# EAGLE design OSI_BORD_HACKADEMY (EAGLE 9.3.2)
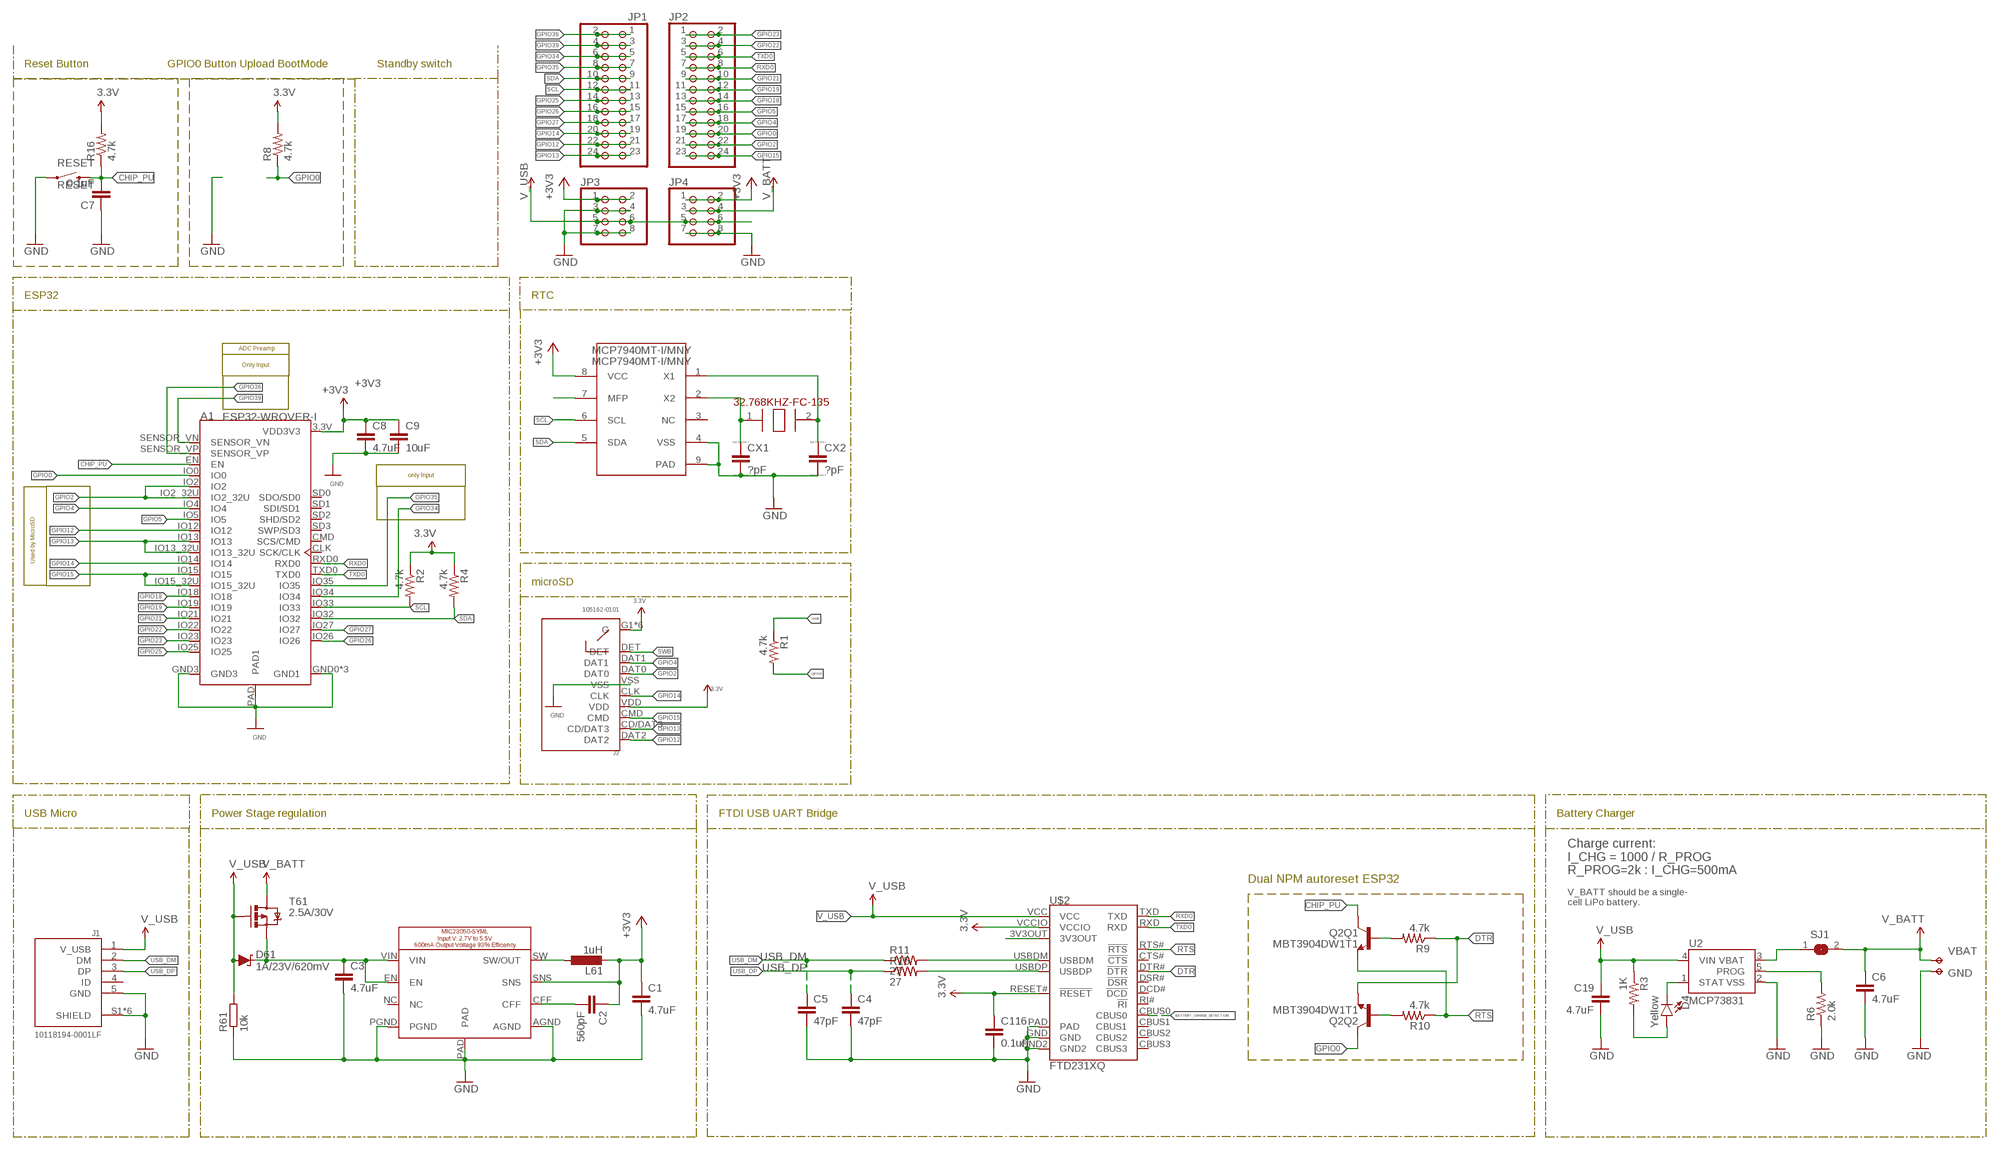
[diagram p0: schematic, sheet 1]

## Parts
A1  ESP32-WROVER-I  [XCVR_ESP32-WROVER-I]
C1  4.7uF  C-EUC0402  [C0402]
C2  560pF  C-EUC0402  [C0402]
C3  4.7uF  C-EUC0402  [C0402]
C4  47pF  C-EUC0402  [C0402]
C5  47pF  C-EUC0402  [C0402]
C6  4.7uF  C-EUC0402  [C0402]
C7  0.1uF  C-EUC0402  [C0402]
C8  4.7uF  C-EUC0402  [C0402]
C9  10uF  C-EUC0402  [C0402]
C19  4.7uF  C-EUC0402  [C0402]
C116  0.1uF  C-EUC0402  [C0402]
CX1  ?pF  CC0402  [C0402]
CX2  ?pF  CC0402  [C0402]
D4  Yellow  LED-YELLOW0603  [LED-0603]
D61  1A/23V/620mV  DIODE-SCHOTTKY-BAT20J  [SOD-323]
GND  TPB1,27  [B1,27]
J1  10118194-0001LF  [AMPHENOL_10118194-0001LF]
J2  105162-0101  [MOLEX_105162-0101]
JP1  PINHD-2X12  [2X12]
JP2  PINHD-2X12  [2X12]
JP3  PINHD-2X4  [2X04]
JP4  PINHD-2X4  [2X04]
L61  1uH  L-EUVLS3015  [VLS3015]
MCP7940MT-I/MNY  MCP7940MT-I/MNY  MCP7940MTDFN  [TDFN-8]
Q2  MBT3904DW1T1  [SC70-6]
R1  4.7k  R-US_R0402  [R0402]
R2  4.7k  R-US_R0402  [R0402]
R3  1K  R-US_R0402  [R0402]
R4  4.7k  R-US_R0402  [R0402]
R6  2.0k  R-US_R0402  [R0402]
R8  4.7k  R-US_R0402  [R0402]
R9  4.7k  R-US_R0402  [R0402]
R10  4.7k  R-US_R0402  [R0402]
R11  27  R-US_R0402  [R0402]
R15  27  R-US_R0402  [R0402]
R16  4.7k  R-US_R0402  [R0402]
R61  10k  R-EU_R0402  [R0402]
RESET  RESET  SWITCH-MOMENTARY-2SMD-4.6X2.8MM  [TACTILE_SWITCH_SMD_4.6X2.8MM]
SJ1  SJ  [SJ]
T61  2.5A/30V  MOSFET-PCHANNELDMG2307L  [SOT23-3@1]
U2  MCP73831  [SOT23-5]
U$1  MIC23050-SYML  [DFN8G-0.5-2X2MM]
U$2  FTD231XQ  [QFN-20]
U$3  32.768KHZ-FC-135  [32.768KHZ-FC-135]
VBAT  TPB1,27  [B1,27]

## Nets
+3V3: A1.3.3V(VDD3V3) C1.1 C2.1 C8.1 C9.1 C116.1 J2.G1(G) J2.G2(G) J2.G3(G) J2.G4(G) J2.SH1(G) J2.SH2(G) J2.VDD JP3.1 JP3.2 JP4.1 JP4.2 L61.P$2 MCP7940MT-I/MNY.8(VCC) R2.1 R4.1 R8.2 R16.2 U$1.SNS U$2.RESET#(!RESET) U$2.VCCIO ; supply symbol labelled 3.3V
BATTERY_CHARGE_DETECTION: U$2.CBUS0
CHIP_PU: A1.EN C7.2 Q2.3(Q1:C) R16.1 RESET.3 RESET.4
DTR: Q2.1(Q2:E) R9.1 U$2.DTR#(!DTR)
GND: A1.GND0(GND1) A1.GND1 A1.GND2(GND1) A1.GND3 A1.PAD(PAD1) C1.2 C3.2 C4.2 C5.2 C6.2 C7.1 C8.2 C9.2 C19.2 C116.2 CX1.2 CX2.2 GND.TP J1.5(GND) J1.S1(SHIELD) J1.S2(SHIELD) J1.S3(SHIELD) J1.S4(SHIELD) J1.S5(SHIELD) J1.S6(SHIELD) J2.VSS JP3.3 JP3.4 JP3.7 JP3.8 JP4.7 JP4.8 MCP7940MT-I/MNY.4(VSS) MCP7940MT-I/MNY.9(PAD) R6.1 R61.1 RESET.1 RESET.2 U2.2(VSS) U$1.AGND U$1.PAD U$1.PGND U$2.GND U$2.GND2 U$2.PAD
GPIO0: A1.IO0 JP2.19 JP2.20 Q2.6(Q2:C) R8.1
GPIO2: A1.IO2 A1.IO2_32U J2.DAT0 JP2.21 JP2.22 R1.2
GPIO4: A1.IO4 J2.DAT1 JP2.17 JP2.18
GPIO5: A1.IO5 JP2.15 JP2.16
GPIO12: A1.IO12 J2.DAT2 JP1.21 JP1.22
GPIO13: A1.IO13 A1.IO13_32U J2.CD/DAT3 JP1.23 JP1.24
GPIO14: A1.IO14 J2.CLK JP1.19 JP1.20
GPIO15: A1.IO15 A1.IO15_32U J2.CMD JP2.23 JP2.24
GPIO18: A1.IO18 JP2.13 JP2.14
GPIO19: A1.IO19 JP2.11 JP2.12
GPIO21: A1.IO21 JP2.9 JP2.10
GPIO22: A1.IO22 JP2.3 JP2.4
GPIO23: A1.IO23 JP2.1 JP2.2
GPIO25: A1.IO25 JP1.13 JP1.14
GPIO26: A1.IO26 JP1.15 JP1.16
GPIO27: A1.IO27 JP1.17 JP1.18
GPIO34: A1.IO34 JP1.5 JP1.6
GPIO35: A1.IO35 JP1.7 JP1.8
GPIO36: A1.SENSOR_VP JP1.1 JP1.2
GPIO39: A1.SENSOR_VN JP1.3 JP1.4
N$1: L61.P$1 U$1.SW(SW/OUT)
N$2: D4.C U2.1(STAT)
N$3: SJ1.1 U2.3(VBAT)
N$4: MCP7940MT-I/MNY.7(MFP)
N$5: C2.2 U$1.CFF
N$6: C3.1 D61.C T61.2(S) U$1.EN U$1.VIN
N$12: CX1.1 MCP7940MT-I/MNY.2(X2) U$3.1(1.XIN)
N$15: CX2.1 MCP7940MT-I/MNY.1(X1) U$3.2(2.XIN)
N$16: R6.2 U2.5(PROG)
N$17: D4.A R3.2
N$36: U$2.3V3OUT
N$93: Q2.5(Q1:B) R9.2
N$94: Q2.2(Q2:B) R10.2
N$95: R11.2 U$2.USBDM
N$96: R15.2 U$2.USBDP
RTS: Q2.4(Q1:E) R10.1 U$2.RTS#(!RTS)
RXD0: A1.RXD0 JP2.7 JP2.8 U$2.TXD
SCL: A1.IO33 JP1.11 JP1.12 MCP7940MT-I/MNY.6(SCL) R2.2
SDA: A1.IO32 JP1.9 JP1.10 MCP7940MT-I/MNY.5(SDA) R4.2
SWB: J2.DET R1.1
TXD0: A1.TXD0 JP2.5 JP2.6 U$2.RXD
USB_DM: C5.1 J1.2(DM) R11.1
USB_DP: C4.1 J1.3(DP) R15.1
V_BATT: C6.1 JP4.3 JP4.4 SJ1.2 T61.3(D) VBAT.TP
V_USB: C19.1 D61.A J1.1(V_USB) JP3.5 JP3.6 JP4.5 JP4.6 R3.1 R61.2 T61.1(G) U2.4(VIN) U$2.VCC
Unconnected: A1.CLK(SCK/CLK) A1.CMD(SCS/CMD) A1.SD0(SDO/SD0) A1.SD1(SDI/SD1) A1.SD2(SHD/SD2) A1.SD3(SWP/SD3) J1.4(ID) MCP7940MT-I/MNY.3(NC) U$1.NC U$2.CBUS1 U$2.CBUS2 U$2.CBUS3 U$2.CTS#(!CTS) U$2.DCD#(!DCD) U$2.DSR#(!DSR) U$2.RI#(!RI)

## Notes on the sheet
- Reset Button | GPIO0 Button Upload BootMode | Standby switch
- ESP32 | RTC
- ADC Preamp
- Only Input
- only Input
- Used by MicroSD
- microSD
- USB Micro | Power Stage regulation | FTDI USB UART Bridge | Battery Charger
- Charge current:
  I_CHG = 1000 / R_PROG
  R_PROG=2k : I_CHG=500mA
- Dual NPM autoreset ESP32
- V_BATT should be a single-
  cell LiPo battery.
- USB Type-C VBUS Battery Charge

## Library data of the parts
A1 = ESP32-WROVER-I++32D:ESP32-WROVER-I: Module: combo; GPIO, I2C x2, I2S x2, SDIO, SPI x3, UART x3; U.FL; AVAILABILITY: Unavailable; DESCRIPTION: Module: combo; GPIO, I2C x2, I2S x2, SDIO, SPI x3, UART x3; U.FL; MF: Espressif Systems; MP: ESP32-WROVER-I; PACKAGE: Module Espressif Systems; PRICE: None
C1-C3 C8 C9 = rcl:C-EU: CAPACITOR, European symbol; SPICEPREFIX: C
C4-C7 C19 C116 = resistor:C-EU: CAPACITOR, European symbol
CX1 CX2 = eagle-ltspice:C: CAPACITOR, European symbol; SPICEMODEL: NONE; SPICEPREFIX: C
D4 = SparkFun-LED:LED-YELLOW: Yellow SMD LED Used in manufacturing several products at SparkFun. Packages: 0603 - SMD 0603 package[Product Link] <http://www.kingbrightusa.com/product.asp?catalog_name=LED&product_id=APT1608SYCK> 0603 -SMART - SMART SMD 0603 package (more efficient/more expensive) [Product Link] <http://www.osram-os.com/osram_os/en/products/product-catalog/led-light-emitting-diodes/smartled-0603/ly-l29k/index.jsp> LilyPad - SMD1206 package[Product Datasheet] <https://www.sparkfun.com/datasheets/DevTools/LilyPad/Q150YUS4.pdf> SparkFun Products: Blynk Board <https://www.sparkfun.com/products/13794> IOIO-OTG <https://www.sparkfun.com/products/13613> XBee Explorer Serial <https://www.sparkfun.com/products/13225>; PROD_ID: DIO-09003
D61 = SparkFun-DiscreteSemi:DIODE-SCHOTTKY: Schottky diode A Schottky diode is a semiconductor diode which has a low forward voltage drop and a very fast switching action.; PROD_ID: DIO-11623
GND VBAT = testpad:TP: Test pad
J1 = 10118194-0001LF:10118194-0001LF: Micro Usb, 2.0 Type b, Rcpt, Smt; AVAILABILITY: Unavailable; DESCRIPTION: Micro Usb, 2.0 Type b, Rcpt, Smt; MF: Amphenol ICC; MP: 10118194-0001LF; PACKAGE: None; PRICE: None
J2 = Micro SD - 105162-0101 - MOLEX :105162-0101: 1.10mm Pitch microSD Card Header with Detect Pin, Height 1.45mm, Lead-Free, Gold (Au) Plated 0.762µm; AVAILABILITY: Unavailable; DESCRIPTION: 1.10mm Pitch microSD Card Header with Detect Pin, Height 1.45mm, Lead-Free, Gold _Au_ Plated 0.762µm; MF: Molex; MP: 105162-0101; PACKAGE: None; PRICE: None
JP1 JP2 = pinhead:PINHD-2X12: PIN HEADER
JP3 JP4 = pinhead:PINHD-2X4: PIN HEADER
L61 = rcl:L-EU: INDUCTOR, European symbol
MCP7940MT-I/MNY = mylibrary:MCP7940M
Q2 = esp32-thing-temp:MBT3904DW1T1: MBT3904DW1 Dual NPN Transistors The MBT3904W1 puts two general purpose 3904 NPN transistors in a single package. Datasheet <http://www.onsemi.com/pub_link/Collateral/MBT3904DW1T1-D.PDF>; PROD_ID: TRANS-13337
R1-R4 R6 R8-R11 R15 R16 = audio amplifier example:R-US_: RESISTOR, American symbol
R61 = resistor:R-EU_: RESISTOR, European symbol
RESET = SparkFun-Electromechanical:SWITCH-MOMENTARY-2: Various NO switches- pushbuttons, reed, etc; PROD_ID: SWCH-13065
SJ1 = jumper:SJ: SMD solder JUMPER
T61 = SparkFun-DiscreteSemi:MOSFET-PCHANNEL: Generic PMOSFET IRLML2244 - TRANS-11153 (SOT-23 -20V -4.3A) (1.Gate 2.Source 3.Drain) FQP27P06 - COM-10349 <http://www.sparkfun.com/products/10349> (TO-220 -60V -27A) (1.Gate 2.Source 3.Drain); PROD_ID: TRANS-11308
U2 = SparkFun-PowerIC:MCP73831: Miniature single cell, fully integrated Li-Ion, Li-polymer charge management controller http://ww1.microchip.com/downloads/en/DeviceDoc/20001984g.pdf IC-09995; PROD_ID: IC-09995
U$1 = MIC23050-SYML:MIC23050-SYML
U$2 = FT231XQ:FTD231XQ
U$3 = 32.768KHZ-FC-135:32.768KHZ-FC-135

## Board
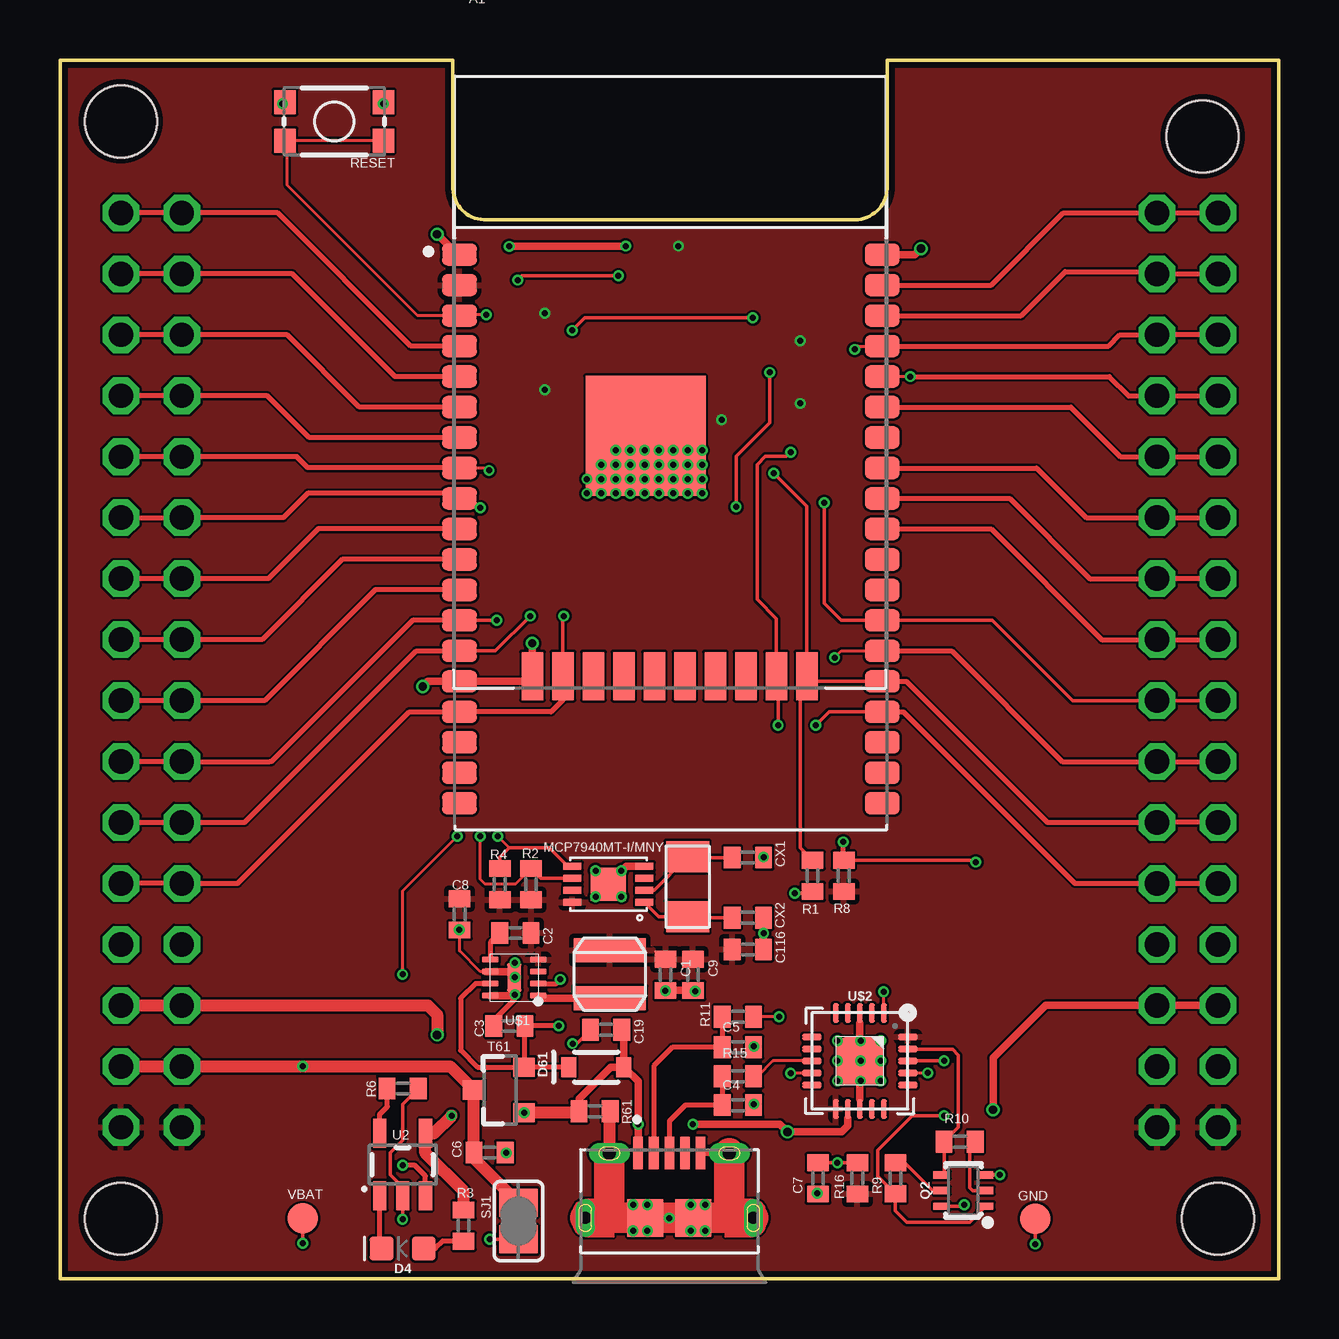
[diagram p1: board, top side]
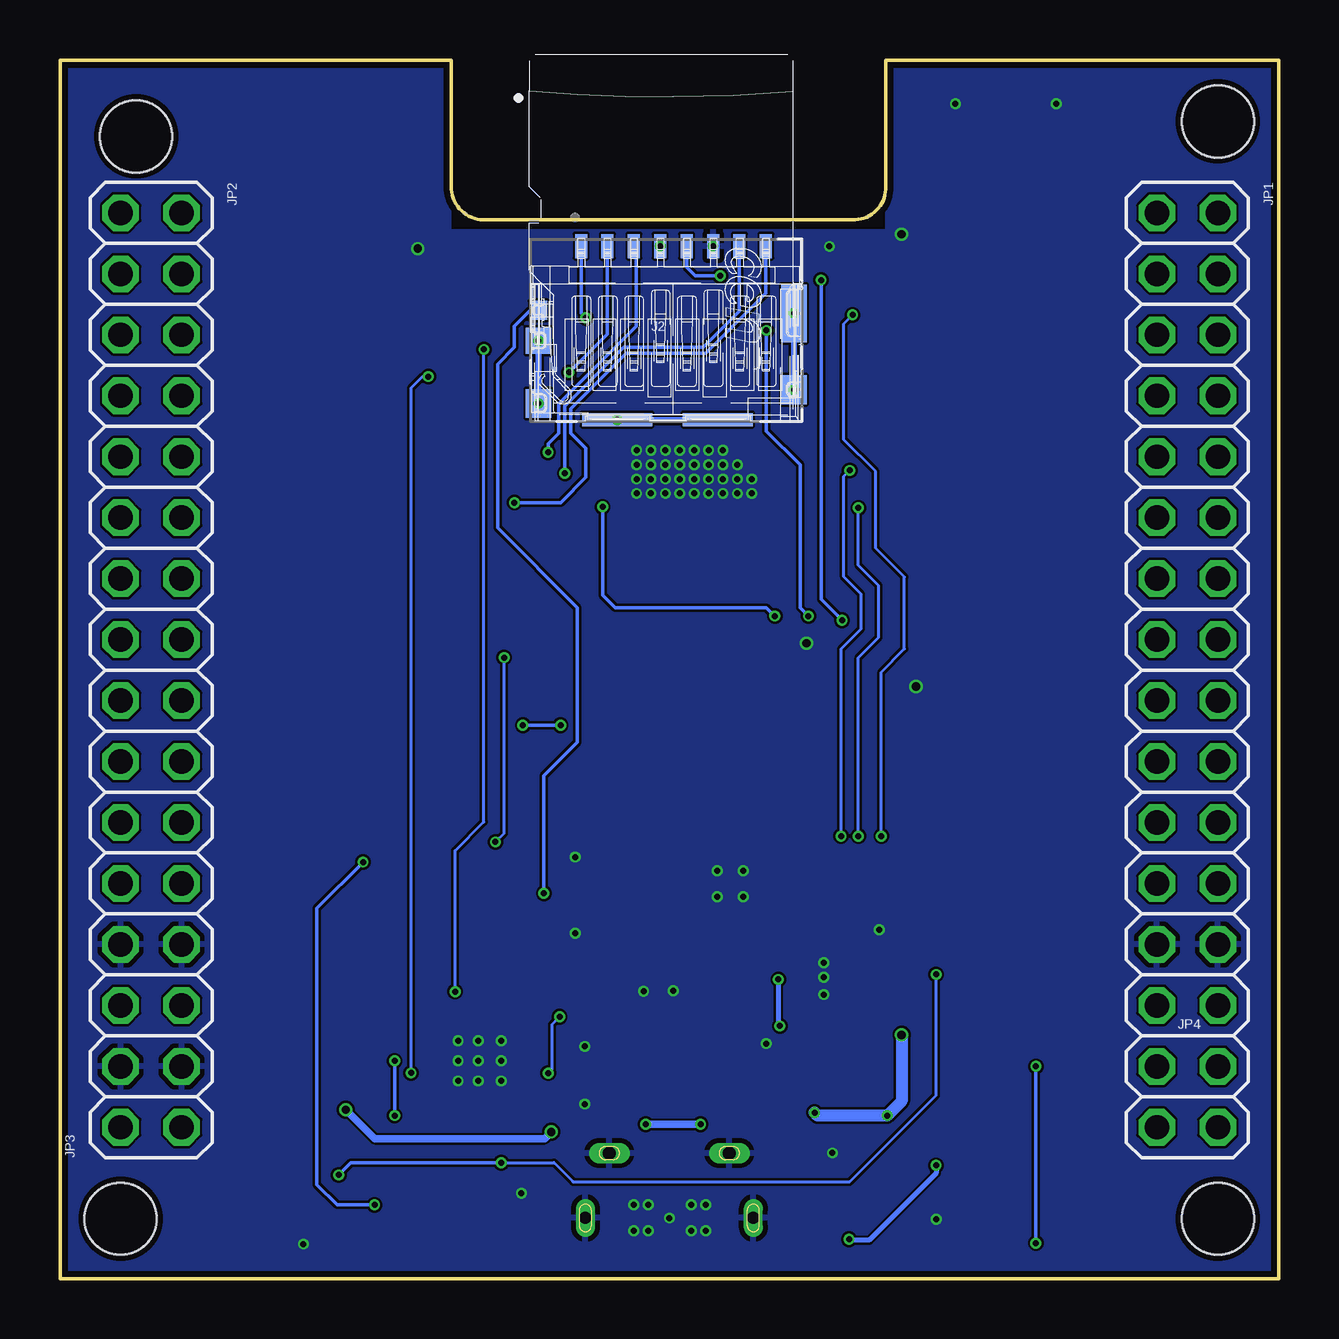
[diagram p2: board, bottom side, seen from below]

Size 50.78 x 50.79 mm. Coordinates in mm from the lower left corner, seen from the top.
Outline: 50.78,0 50.78,50.79 34.47,50.79 34.47,45.4 arc-90 33.01,44.13 17.77,44.13 arc-90 16.37,45.4 16.37,50.79 0,50.79 0,0 50.78,0
Copper layers (1*16): Top 0.012mm / dielectric 0.36mm / Bottom 0.012mm
Design rules "JLPCB 2 layer": minimum track width 0.125mm, minimum drill 0.25mm, track to track 0.1mm, track to pad 0.1mm, pad to pad 0.1mm, via to via 0.1mm, smd to smd 0mil, copper to edge 0.25mm, drill to drill 0.35mm, minimum pad ring 0.15mm, minimum via ring 0.1mm, stop-mask expansion 0mil, vias tented up to drill 0.45mm, thermal gap 0.2mm
Holes 3 mm at 2.54,48.23 47.6,47.61 48.25,2.51 2.54,2.51

### Footprints (pad centres in the part's own frame; a part is rotated, then mirrored left to right if it is on the bottom)
XCVR_ESP32-WROVER-I = smd 1.45 x 0.93: 3.3V -8.81,6.99; CLK 8.81,-14.6; CMD -8.81,-14.6; EN -8.81,5.72; GND0 -8.81,8.26; GND1 8.81,8.26; GND2 -8.81,-9.52; IO0 8.81,-8.25; IO2 8.81,-9.52; IO4 8.81,-6.98; IO5 8.81,-3.17; IO12 -8.81,-8.25; IO13 -8.81,-10.79; IO14 -8.81,-6.98; IO15 8.81,-10.79; IO18 8.81,-1.9; IO19 8.81,-0.63; IO21 8.81,1.91; IO22 8.81,5.72; IO23 8.81,6.99; IO25 -8.81,-3.17; IO26 -8.81,-4.44; IO27 -8.81,-5.71; IO32 -8.81,-0.63; IO33 -8.81,-1.9; IO34 -8.81,1.91; IO35 -8.81,0.64; NC 8.81,0.64; NC1 8.81,-4.44; NC2 8.81,-5.71; RXD0 8.81,3.18; SD0 8.81,-13.33; SD1 8.81,-12.06; SD2 -8.81,-12.06; SD3 -8.81,-13.33; SENSOR_VN -8.81,3.18; SENSOR_VP -8.81,4.45; TXD0 8.81,4.45 | smd 0.9 x 2: CLK_32U 0.584,-9.304; CMD_32U -0.686,-9.304; GND3 -5.766,-9.304; IO2_32U 5.664,-9.304; IO13_32U -4.496,-9.304; IO15_32U 4.394,-9.304; SD0_32U 1.854,-9.304; SD1_32U 3.124,-9.304; SD2_32U -3.226,-9.304; SD3_32U -1.956,-9.304 | smd 5 x 5: PAD -1.051,0.706
C0402 = smd 0.7 x 0.9: 1 -0.65,0; 2 0.65,0
LED-0603 = smd 1 x 1: A -0.877,0; C 0.877,0
SOD-323 = smd 0.63 x 0.83: A 1.15,0; C -1.15,0
B1,27 = smd 1.27 x 1.27: TP 0,0
AMPHENOL_10118194-0001LF = smd 0.4 x 1.35: 1 -1.3,2.7; 2 -0.65,2.7; 3 0,2.7; 4 0.65,2.7; 5 1.3,2.7 | drill 0.55 pad 0.65 long: S1 -2.5,2.7; S2 2.5,2.7 | drill 0.5 pad 0.775 long: S3 -3.5,0; S6 3.5,0 | smd 1.5 x 1.55: S4 -1,0; S5 1,0
MOLEX_105162-0101 = smd 0.5 x 1: CD/DAT3 2.45,-3.515; CLK -0.85,-3.515; CMD 1.35,-3.515; DAT0 -3.05,-3.515; DAT1 -4.15,-3.515; DAT2 3.55,-3.515; VDD 0.25,-3.515; VSS -1.95,-3.515 | smd 0.72 x 0.78: DET 5.31,-0.835 | smd 1.05 x 1.08: G1 5.325,0.435 | smd 1.05 x 1.2: G2 5.325,3.045; G3 -5.325,2.475 | smd 1.05 x 2.39: G4 -5.325,-0.71 | smd 2.91 x 0.55: SH1 -2.145,3.72; SH2 2.045,3.72
2X12 = drill 1.016 octagon: 1 -13.97,-1.27; 2 -13.97,1.27; 3 -11.43,-1.27; 4 -11.43,1.27; 5 -8.89,-1.27; 6 -8.89,1.27; 7 -6.35,-1.27; 8 -6.35,1.27; 9 -3.81,-1.27; 10 -3.81,1.27; 11 -1.27,-1.27; 12 -1.27,1.27; 13 1.27,-1.27; 14 1.27,1.27; 15 3.81,-1.27; 16 3.81,1.27; 17 6.35,-1.27; 18 6.35,1.27; 19 8.89,-1.27; 20 8.89,1.27; 21 11.43,-1.27; 22 11.43,1.27; 23 13.97,-1.27; 24 13.97,1.27
2X04 = drill 1.016 octagon: 1 -3.81,-1.27; 2 -3.81,1.27; 3 -1.27,-1.27; 4 -1.27,1.27; 5 1.27,-1.27; 6 1.27,1.27; 7 3.81,-1.27; 8 3.81,1.27
VLS3015 = smd 1 x 3: P$1 -1,0; P$2 1,0
TDFN-8 = smd 0.3 x 0.75: 1 -0.75,-1.5; 2 -0.25,-1.5; 3 0.25,-1.5; 4 0.75,-1.5; 5 0.75,1.5; 6 0.25,1.5; 7 -0.25,1.5; 8 -0.75,1.5 | smd 1.36 x 1.46: 9 0,0
SC70-6 = smd 0.3 x 0.66: 1 -0.65,-0.92; 2 0,-0.92; 3 0.65,-0.92; 4 0.65,0.92; 5 0,0.92; 6 -0.65,0.92
R0402 = smd 0.7 x 0.9: 1 -0.65,0; 2 0.65,0
TACTILE_SWITCH_SMD_4.6X2.8MM = smd 0.9 x 1: 1 -2.05,-0.8; 2 2.05,-0.8; 3 2.05,0.8; 4 -2.05,0.8
SJ = smd 1.168 x 1.6: 1 -0.762,0; 2 0.762,0
SOT23-3@1 = smd 0.8 x 0.9: 1 -0.95,-1; 2 0.95,-1; 3 0,1.1
SOT23-5 = smd 0.55 x 1.2: 1 -0.95,-1.3; 2 0,-1.3; 3 0.95,-1.3; 4 0.95,1.3; 5 -0.95,1.3
DFN8G-0.5-2X2MM = smd 0.7 x 0.25: AGND 2,-1.25; CFF 2,-1.75; EN 0,-0.75; NC 0,-1.25; PGND 2,-0.25; SNS 0,-1.75; SW 0,-0.25; VIN 2,-0.75 | smd 0.6 x 1.2: PAD 1,-1
QFN-20 = smd 0.25 x 0.8: 3V3OUT 1,-2; CBUS2 -0.5,-2; CBUS3 1,2; CTS# -1,-2; DTR# 0,2; RTS# -0.5,2; TXD 0.5,2; USBDM 0.5,-2; USBDP 0,-2; VCCIO -1,2 | smd 0.8 x 0.25: CBUS0 2,1; CBUS1 2,0.5; DCD# -2,-1; DSR# -2,-0.5; GND -2,0; GND2 2,0; RESET# 2,-1; RI# -2,0.5; RXD -2,1; VCC 2,-0.5 | smd 2 x 2: PAD 0,0
32.768KHZ-FC-135 = smd 1.3 x 1.8: 1 0,0; 2 2.5,0

### Placement (x,y rotation side)
A1  25.45,34.42 0 top
C1  25.23,12.67 270 top
C2  18.98,14.41 180 top
C3  18.72,10.54 180 top
C4  28.25,7.24 0 top
C5  28.25,9.65 0 top
C6  17.9,5.27 0 top
C7  31.58,4.19 90 top
C8  16.65,15.19 270 top
C9  26.37,12.67 270 top
C19  22.75,10.38 180 top
C116  28.67,13.73 0 top
CX1  28.66,17.56 0 top
CX2  28.66,15.05 0 top
D4  14.28,1.27 180 top
D61  22.34,8.83 0 top
GND  40.63,2.51 0 top
J1  25.39,2.54 0 top
J2  25.52,39.52 180 bottom
JP1  3.81,30.45 270 bottom
JP2  46.98,30.45 270 bottom
JP3  46.98,10.13 90 bottom
JP4  3.81,10.13 90 bottom
L61  22.91,12.7 90 top
MCP7940MT-I/MNY  22.85,16.45 90 top
Q2  37.65,3.68 90 top
R1  31.36,16.8 90 top
R2  19.63,16.45 90 top
R3  16.82,2.22 270 top
R4  18.33,16.45 90 top
R6  14.28,7.94 180 top
R8  32.66,16.8 270 top
R9  34.81,4.19 90 top
R10  37.49,5.71 0 top
R11  28.25,10.92 0 top
R15  28.25,8.45 0 top
R16  33.22,4.19 270 top
R61  22.28,6.99 180 top
RESET  11.42,48.23 180 top
SJ1  19.1,2.41 90 top
T61  18.34,7.87 90 top
U2  14.28,4.76 0 top
U$1  19.93,11.56 180 top
U$2  33.33,9.08 270 top
U$3  26.15,17.59 270 top
VBAT  10.11,2.52 0 top

### Tracks (layer width: path | path; a pad name or v marks a point on that pad's centre or on a via)
+3V3  (via drill 0.25)
  Bottom 0.152: J2.SH1 23.42,35.84 24.14,35.84
  Bottom 0.254: J2.G1 J2.G2 | J2.SH2 24.19,35.8 24.14,35.84 | J2.G3 J2.G4
  other vias: 25.77,43.04 20.2,37.05 20.2,40.23 27.57,35.8 30.85,39.09 30.85,36.48
  pour Top: -2.55,56.2 53.33,56.2 53.33,-3.81 -2.55,-3.81
CHIP_PU  (via drill 0.25)
  Top 0.127: v14.27,12.69 14.27,16.17 v16.55,18.45 | v17.76,40.17 16.67,40.17 A1.EN 14.91,40.14 9.47,45.57 9.47,47.43 | RESET.4 9.47,47.43 | 9.47,47.43 RESET.3
  Top 0.152: C7.2 v32.39,4.84 R16.1 | Q2.3 v39.16,4.33
  Bottom 0.127: v32.39,4.84 30.19,4.84 29.39,4.05 17.88,4.05 14.27,7.65 v14.27,12.69 | v16.55,18.45 16.55,25.29 15.59,26.25 15.59,29.25 16.8,30.45 16.8,33.64 18.12,34.96 18.12,39.81 v17.76,40.17
  Bottom 0.152: v32.39,4.84 38.66,4.84 v39.16,4.33
DTR  (via drill 0.25)
  Top 0.152: Q2.1 38.57,3.02 37.91,2.37 35.27,2.37 34.81,2.83 R9.1 34.07,4.28 34.07,5.37 35.52,6.81 v36.84,6.81 | v36.84,9.09 v36.83,9.08 U$2.DTR#
  Bottom 0.152: v36.84,6.81 v36.84,9.09
GND  (via drill 0.25, 0.35)
  Top 0.127: 33.33,10.64 U$2.GND | 33.33,7.49 U$2.GND2 | U$1.AGND 17.76,12.81 17.52,12.81 16.65,13.67 C8.2 | 26.25,12.02 C9.2
  Top 0.15: C19.2 21.53,9.81 v21.36,9.81 | v14.27,2.49 v14.28,2.49 U2.2 14.28,3.82 13.76,4.34 13.76,5.26 14.27,5.77 14.27,7.28 R6.1 | GND.TP v40.63,1.45
  Top 0.152: 19.65,25.07 A1.GND3 | C6.2 18.57,5.27 v18.6,5.25 | A1.PAD 23.64,35.12 23.62,35.14 | 22.92,35.84 23.62,35.14 | 23.62,35.14 23.8,35.14 23.8,34.57 v23.76,34.53
  Top 0.203: C3.2 18.07,10.78 18.93,11.64 18.93,11.81 | 18.93,11.81 U$1.PAD | 18.68,12.81 U$1.AGND | 18.93,11.81 | J1.5 J1.S2 | J1.S1 22.89,5.01 22.89,4.04 | 24.34,2.59 J1.S4 | 26.97,3.12 J1.S5
  Top 0.305: U$1.PAD 18.68,12.81 17.76,12.81 | U$1.PGND 18.93,11.81 | 19.65,25.07 19.47,24.9 A1.GND2 15.32,24.9 v15.11,24.69 | A1.GND3 v19.68,26.49 | A1.GND0 16.57,42.68 v15.71,43.53 | A1.GND1 35.62,42.68 v35.88,42.93 | MCP7940MT-I/MNY.4 23.58,17.2 v23.39,17.01 | RESET.1 v13.47,48.97 | v25.23,12 v25.23,12.01 C1.2 26.25,12.02 | MCP7940MT-I/MNY.9 23.37,15.93 v23.39,15.93 | J2.VSS 18.74,43.04 v18.72,43.02 | RESET.2 9.31,48.97 v9.27,48.97 | CX1.2 v29.32,17.58 | C116.2 29.31,14.49 | CX2.2 29.31,14.49 | v29.32,14.41 29.32,14.49 29.31,14.49 | U$2.PAD v33.35,9.08 v33.35,9.09 | U$2.PAD 33.33,10.64 | U$2.PAD 33.33,7.49 | C5.2 28.92,9.67 v28.92,9.69 | C4.2 28.92,7.26 v28.92,7.29 | C7.1 v31.55,3.57 | v31.55,3.57 | C8.2 v16.64,14.55
  Top 0.508: R61.1 22.89,6.95 J1.S1
  Top 1.27: J1.S3 23.16,2.54 | 23.16,2.54 24.29,2.54 24.34,2.59 | J1.S4 J1.S5 27.96,2.54 | J1.S6 27.96,2.54 | 27.89,4.19 J1.S2 27.89,2.61 27.96,2.54 | 23.16,2.54 22.89,2.8 22.89,5.01
  other vias: 21.96,32.73 22.55,32.73 23.16,32.73 23.76,32.73 24.36,32.73 24.96,32.73 25.55,32.73 26.16,32.73 26.76,32.73 26.76,33.33 26.16,33.33 25.55,33.33 24.96,33.33 24.36,33.33 23.76,33.33 23.16,33.33 22.55,33.33 21.96,33.33 22.55,33.93 23.16,33.93 23.76,33.93 24.36,33.93 24.96,33.93 25.55,33.93 26.16,33.93 26.76,33.93 26.76,34.53 26.16,34.53 25.55,34.53 24.96,34.53 24.36,34.53 23.16,34.53 22.32,17.01 22.32,15.93 18.96,13.17 18.96,12.57 18.96,11.85 32.39,9.93 33.35,9.93 34.2,9.93 32.39,9.09 34.2,9.09 32.39,8.25 33.35,8.25 34.2,8.25 23.88,3.09 24.48,3.09 26.28,3.09 26.88,3.09 25.39,2.54 26.28,2.01 26.88,2.01 24.48,2.01 23.88,2.01 26.46,11.99 23.57,43.04
  pour Bottom: -1.28,54.93 52.06,54.93 52.06,-2.54 -1.28,-2.54
GPIO0  (via drill 0.25)
  Top 0.127: v32.27,25.89 32.55,26.17 A1.IO0
  Top 0.15: Q2.6 37.62,3.03 v37.67,3.09 | v38.15,17.37 38.08,17.45 R8.1
  Top 0.2: A1.IO0 37.15,26.17 41.77,21.56 JP2.20 JP2.19 | R8.1 32.63,17.47 v32.63,18.21
  Bottom 0.127: v32.63,18.21 32.27,18.57 v32.27,25.89
  Bottom 0.15: v37.67,3.09 39.23,3.09 40.07,3.93 40.07,15.45 v38.15,17.37
GPIO2  (via drill 0.25)
  Top 0.152: v29.75,33.57 31.12,32.19 A1.IO2_32U 31.36,24.87 | R1.2 30.83,17.97 30.83,24.35 31.36,24.87 | A1.IO2 31.38,24.9 31.36,24.87
  Top 0.203: A1.IO2 35.27,24.9 41.14,19.02 JP2.22 JP2.21
  Bottom 0.152: J2.DAT0 22.47,40.32 23.97,38.82 27.3,38.82 29.75,36.37 v29.75,33.57
GPIO4  (via drill 0.25)
  Top 0.152: v31.85,32.34 31.85,28.14 32.55,27.44 A1.IO4 38.84,27.44 42.19,24.1 JP2.18 JP2.17
  Bottom 0.152: J2.DAT1 21.37,41.06 23.87,38.57 27.19,38.57 29.49,36.26 29.49,35.24 28.87,34.62 28.87,33.39 29.92,32.34 v31.85,32.34
GPIO5
  Top 0.2: A1.IO5 38.79,31.25 43.4,26.64 JP2.16 JP2.15
GPIO12  (via drill 0.25)
  Top 0.152: 16.62,26.17 A1.IO12 18.14,26.17 v19.6,27.62 | 7.7,19.02 5.42,19.02 JP1.21 JP1.22 | v28.87,40.04 21.87,40.04 v21.35,39.52
  Top 0.2: JP1.22 5.42,19.02 | JP1.21 7.7,19.02 14.84,26.17 16.62,26.17
  Bottom 0.152: J2.DAT2 29.07,40.24 v28.87,40.04 | v19.6,27.62 19.95,27.97 19.95,33.92 21.35,35.32 v21.35,39.52
GPIO13  (via drill 0.25)
  Top 0.152: v29.57,37.77 29.57,35.67 28.17,34.27 v28.17,32.17 | v21,27.62 20.96,27.58 A1.IO13_32U | 2.62,16.48 JP1.24
  Top 0.2: 2.62,16.48 JP1.23 7.41,16.48 14.55,23.63 A1.IO13 20.47,23.63 20.96,24.12 A1.IO13_32U
  Bottom 0.152: J2.CD/DAT3 27.97,39.37 v29.57,37.77 | v28.17,32.17 28.17,28.49 27.64,27.97 21.35,27.97 v21,27.62
GPIO14  (via drill 0.25)
  Top 0.152: v23.27,41.79 19.25,41.79 v19.07,41.62 | v18.2,27.44 v18.19,27.44 A1.IO14 | 8.74,21.56 8.81,21.56 | 2.62,21.56 JP1.20
  Top 0.2: A1.IO14 14.69,27.44 8.81,21.56 | 8.74,21.56 JP1.19 2.62,21.56
  Bottom 0.152: J2.CLK 24.67,42.14 24.32,41.79 v23.27,41.79 | v19.07,41.62 19.07,28.32 v18.2,27.44
GPIO15  (via drill 0.25)
  Top 0.152: v30.45,34.44 30.27,34.27 29.39,34.27 29.05,33.92 29.05,28.32 29.85,27.51 A1.IO15_32U 29.92,25.04 v29.92,23.07 | A1.IO15 32.05,23.63 v31.5,23.07
  Top 0.203: A1.IO15 35.14,23.63 42.28,16.48 JP2.24 JP2.23
  Bottom 0.152: J2.CMD 26.77,42.94 26.77,39.69 27.39,39.07 27.4,39.07 30,36.47 30,35.24 30.45,34.79 v30.45,34.44 | v31.5,23.07 v29.92,23.07
GPIO18
  Top 0.2: A1.IO18 39.57,32.52 42.9,29.18 JP2.14 JP2.13
GPIO19
  Top 0.2: A1.IO19 40.7,33.79 42.77,31.72 JP2.12 JP2.11
GPIO21
  Top 0.2: A1.IO21 42.11,36.33 44.18,34.26 JP2.10 JP2.9
GPIO22
  Top 0.2: A1.IO22 40.04,40.14 41.88,41.97 45.62,41.97 JP2.4 JP2.3
GPIO23
  Top 0.2: A1.IO23 38.79,41.41 41.8,44.42 JP2.2 JP2.1
GPIO25
  Top 0.2: A1.IO25 10.75,31.25 8.68,29.18 JP1.13 JP1.14
GPIO26
  Top 0.2: A1.IO26 11.76,29.98 8.42,26.64 JP1.15 JP1.16
GPIO27
  Top 0.2: A1.IO27 13.13,28.71 8.52,24.1 JP1.17 JP1.18
GPIO34
  Top 0.2: A1.IO34 12.47,36.33 9.46,39.34 JP1.5 JP1.6
GPIO35
  Top 0.2: A1.IO35 10.38,35.06 8.64,36.8 JP1.7 JP1.8
GPIO36
  Top 0.2: A1.SENSOR_VP 14.61,38.87 9.06,44.42 JP1.1 JP1.2
GPIO39
  Top 0.2: A1.SENSOR_VN 13.96,37.6 9.68,41.88 JP1.3 JP1.4
N$1
  Top 0.305: U$1.SW 20.04,11.7 L61.P$1
N$2
  Top 0.203: D4.C 13.33,1.34 U2.1
N$3  (via drill 0.25)
  Top 0.152: SJ1.1 v17.9,1.65
  Top 0.203: U2.3 15.23,4.29 14.78,4.73 v14.28,4.73
  Bottom 0.203: v14.28,4.73 14.28,4.41 17.07,1.62 17.87,1.62 v17.9,1.65
N$5
  Top 0.203: C2.2 17.93,14.02 U$1.CFF
N$6  (via drill 0.25)
  Top 0.203: D61.C T61.2 | T61.2 19.37,8.85 C3.1 v20.79,10.54 | U$1.VIN 17.31,12.31 16.69,11.68 16.69,9.52 17.39,8.82 T61.2 | U$1.EN 20.68,12.31 v20.85,12.48
  Bottom 0.203: v20.85,12.48 20.85,10.6 v20.79,10.54
N$12
  Top 0.152: U$3.1 26.12,17.56 | MCP7940MT-I/MNY.2 24.76,16.2 26.1,17.54 26.12,17.56 | CX1.1 26.12,17.56
N$15
  Top 0.152: MCP7940MT-I/MNY.1 24.96,15.09 U$3.2 26.19,15.05 CX2.1
N$16
  Top 0.203: U2.5 13.33,6.86 13.64,7.18 13.64,7.92 R6.2
N$17
  Top 0.203: R3.2 15.94,1.57 15.64,1.27 D4.A
N$93
  Top 0.152: Q2.5 36.36,3.68 35.2,4.84 R9.2
N$94
  Top 0.152: Q2.2 38.04,3.68 37.91,3.81 37.91,5.49 R10.2
N$95  (via drill 0.25)
  Top 0.127: U$2.USBDM v30.44,8.57 | v29.96,10.92 R11.2
  Bottom 0.127: v30.44,8.57 30.28,8.73 30.28,10.6 v29.96,10.92
N$96
  Top 0.127: R15.2 29.07,8.45 29.71,9.08 U$2.USBDP
RTS
  Top 0.152: Q2.4 36.84,4.44 R10.1 37.43,6.31 37.43,9.33 37.2,9.57 35.34,9.57 U$2.RTS#
RXD0  (via drill 0.25)
  Top 0.127: U$2.TXD v36.15,8.58 | v35.43,37.6 A1.RXD0
  Top 0.2: JP2.7 JP2.8 44.52,36.8 43.72,37.6 v35.43,37.6
  Bottom 0.127: v36.15,8.58 36.15,37.13 35.68,37.6 v35.43,37.6
SCL  (via drill 0.25)
  Top 0.127: R2.2 18.98,16.45 17.71,16.45 17.52,16.65 v17.52,18.45 | v17.52,32.13 17.13,32.52 A1.IO33
  Top 0.152: MCP7940MT-I/MNY.6 20.03,16.7 R2.2
  Top 0.2: JP1.12 JP1.11 9.3,31.72 10.31,32.73 16.43,32.73 A1.IO33
  Bottom 0.127: v17.52,18.45 17.52,25.89 16.68,26.73 16.68,28.89 17.52,29.73 v17.52,32.13
SDA  (via drill 0.25)
  Top 0.127: 18.71,17.97 v18.23,18.45 | v17.88,33.69 17.78,33.79 A1.IO32
  Top 0.152: MCP7940MT-I/MNY.5 21.17,17.2 20.39,17.97 18.71,17.97 18.32,17.58 R4.2
  Top 0.2: A1.IO32 16.62,33.81 10.31,33.81 9.86,34.26 JP1.9 JP1.10
  Bottom 0.127: v18.23,18.45 18.23,26.25 17.39,27.09 17.39,28.53 18.12,29.25 18.12,33.45 v17.88,33.69
SWB  (via drill 0.25)
  Top 0.152: R1.1 31.28,16.07 v30.62,16.07
  Bottom 0.152: v30.62,16.07 30.62,20.97 29.22,22.37 29.22,27.97 32.54,31.29 32.54,38.12 31.85,38.82 31.85,39.69 31.18,40.36 J2.DET
TXD0  (via drill 0.25)
  Top 0.127: U$2.RXD 34.33,11.96 v34.31,11.97 | v33.11,38.73 33.25,38.87 A1.TXD0
  Top 0.2: A1.TXD0 43.7,38.87 44.16,39.34 JP2.6 JP2.5
  Bottom 0.127: v34.31,11.97 34.31,17.85 33.11,19.05 v33.11,38.73
USB_DM
  Top 0.203: R11.1 C5.1 25.52,9.65 24.74,8.88 J1.2
USB_DP
  Top 0.203: J1.3 25.39,6.57 26.06,7.24 C4.1 R15.1
V_BATT  (via drill 0.25)
  Top 0.15: v10.12,1.49 v10.11,1.49 VBAT.TP
  Top 0.203: 17.25,5.03 C6.1
  Top 0.508: JP4.3 JP4.4 v10.11,8.86 16.26,8.86 T61.3 C6.1 | SJ1.2 17.25,5.03
  Bottom 0.15: v10.12,1.49 v10.12,8.85 v10.11,8.86
V_USB  (via drill 0.25, 0.35)
  Top 0.203: 23.55,8.77 D61.A | U$2.VCC 32.83,6.69 | v30.31,6.13 30.23,6.21
  Top 0.305: 23.55,8.77 24.09,8.23 v24.09,6.45 J1.1 | R61.2 21.63,7.51 22.95,8.83 D61.A 23.49,10.3 C19.1 | 30.23,6.21 29.99,6.45 v26.37,6.45 | v30.31,6.13 32.57,6.13 32.83,6.39 32.83,6.69 | JP3.6 JP3.5 41.06,11.4 38.88,9.21 v38.88,7.05
  Top 0.508: JP4.5 JP4.6 15.32,11.4 15.71,11.01 v15.71,10.17 | v16.32,6.81 15.57,6.06 U2.4 15.23,5.24 16.82,3.65 R3.1 | R61.2 21.57,6.92 T61.1
  Bottom 0.305: v38.88,7.05 37.67,5.85 30.59,5.85 v30.31,6.13 | v26.37,6.45 v24.09,6.45
  Bottom 0.508: v15.71,10.17 15.71,7.41 v16.32,6.81 19.23,6.81 T61.1
  other vias: 19.34,6.92